# Altium project MODEM.PrjPCB
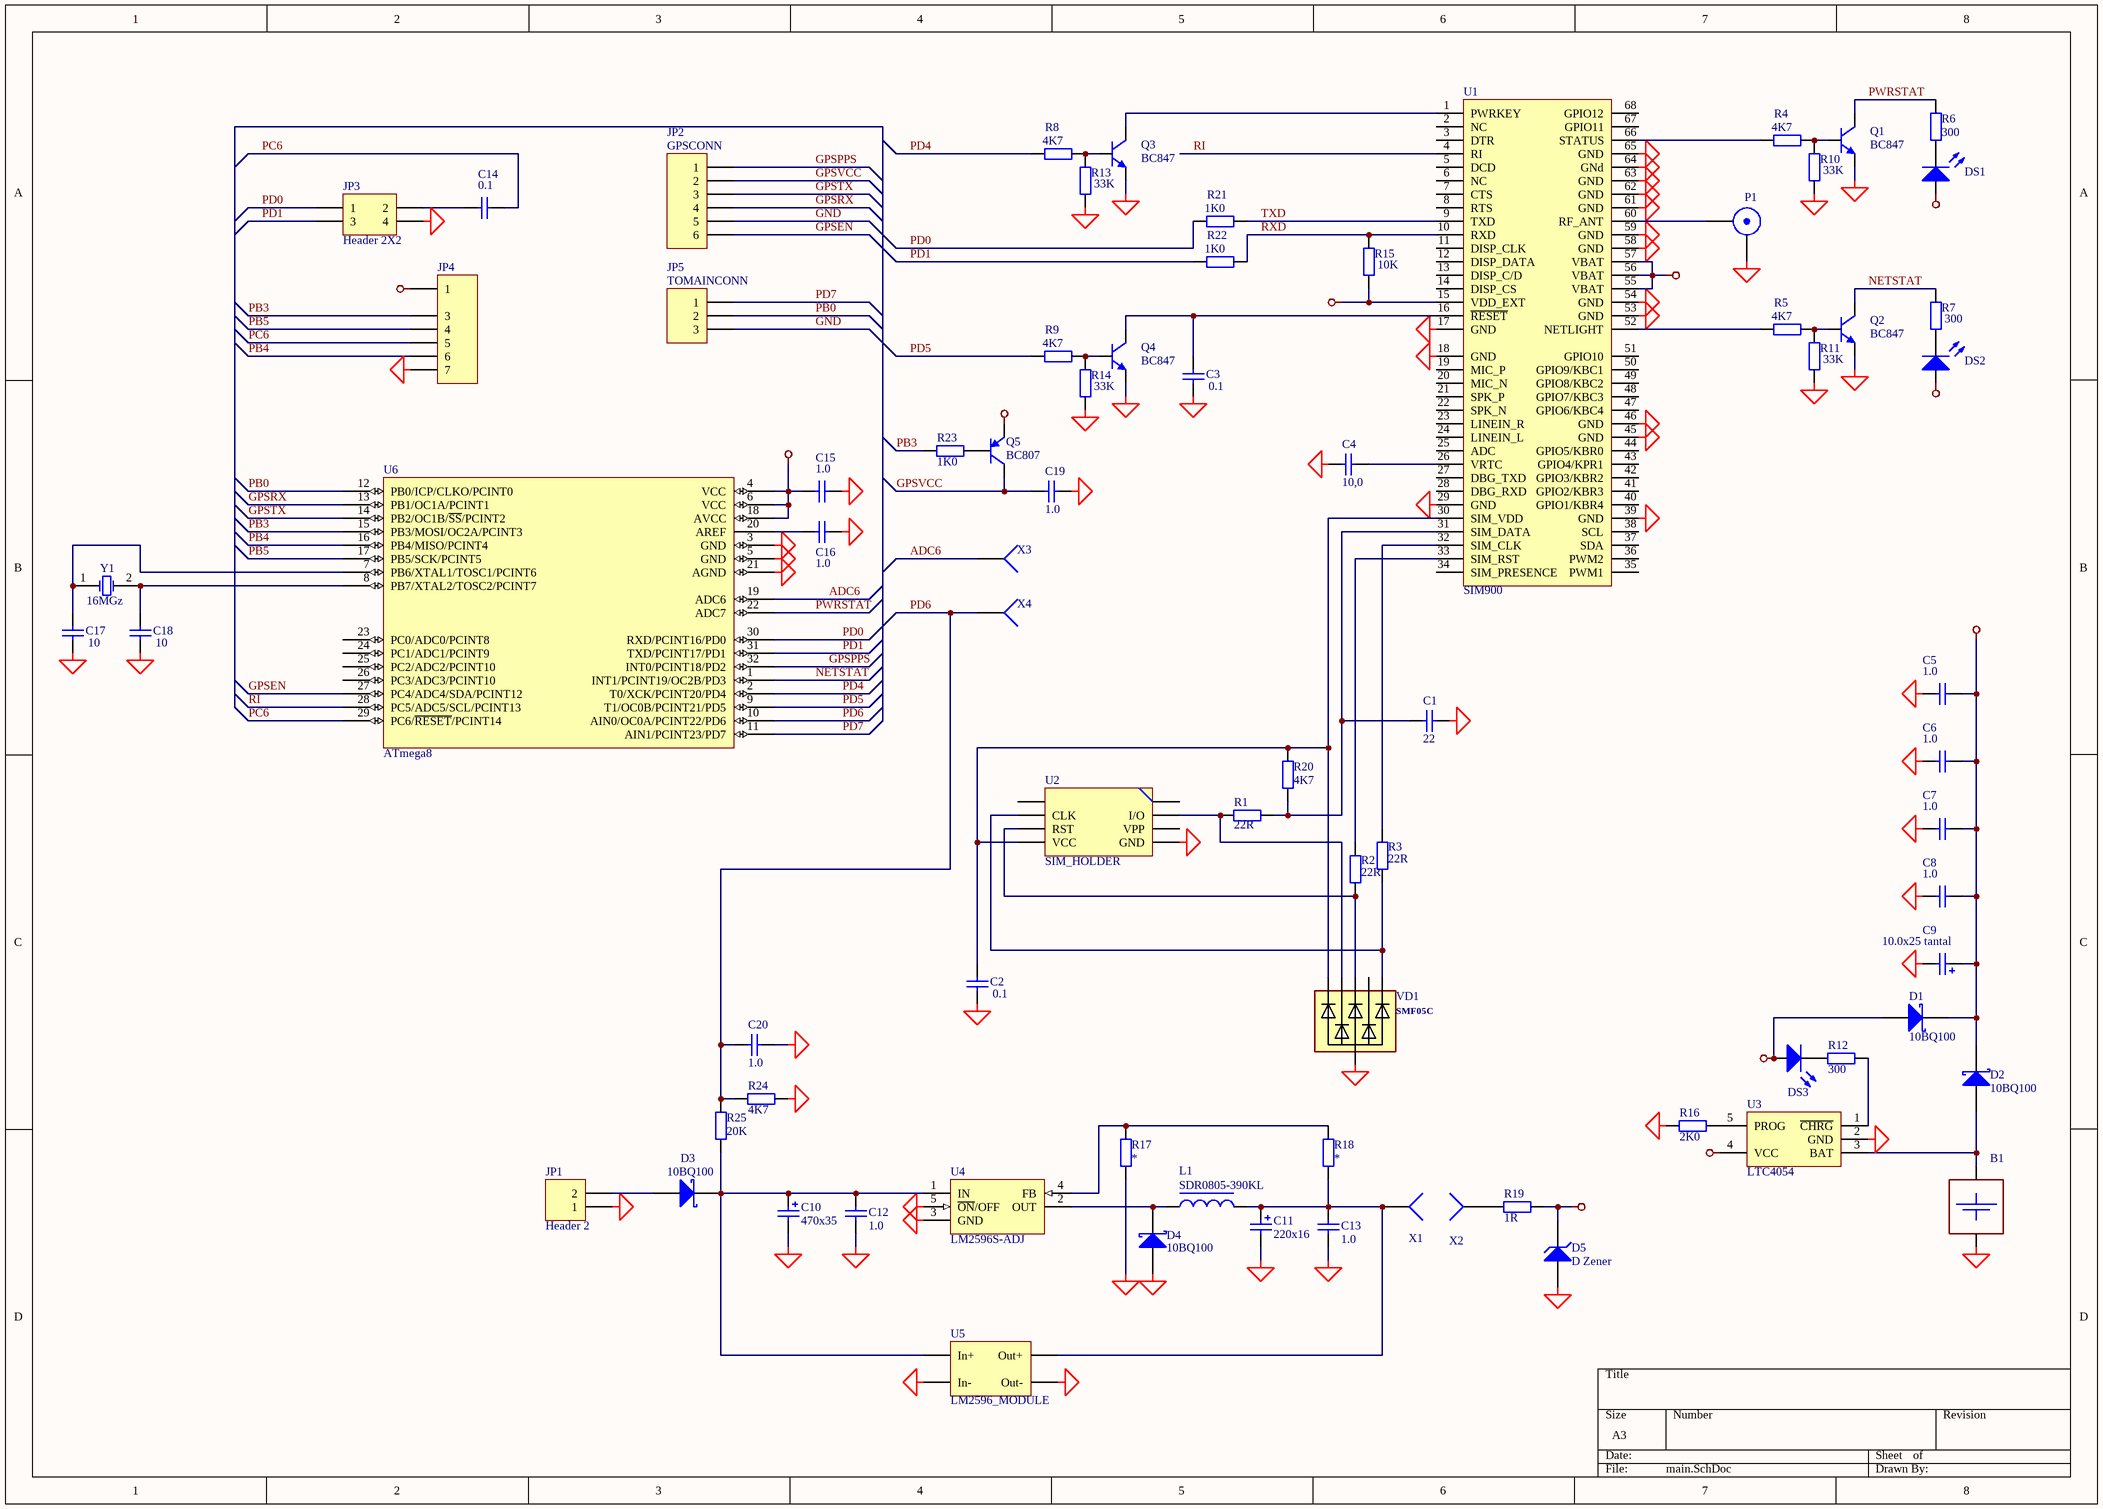
[diagram p0: main.SchDoc]
1 sheet, 78 parts. Net scope: global (net labels, ports and power ports of the same name join across sheets).
Board file: main.PcbDoc

## Sheet main.SchDoc
size A3

### Parts
B1  BAT18650_HOLDER  [BAT18650_HOLDER]  (value not drawn)
C1  22  [_1206]
C2  0.1  [_1206]
C3  0.1  [_1206]
C4  10,0  [_1206]
C5  1.0  [_1206]
C6  1.0  [_1206]
C7  1.0  [_1206]
C8  1.0  [_1206]
C9  10.0x25 tantal  [CAP_EL_6_3]
C10  value 470x35  [el5]
C11  value 220x16  [el3]
C12  value 1.0  [_1206]  (hidden comment: Cap)
C13  value 1.0  [_1206]  (hidden comment: Cap)
C14  0.1  [_1206]
C15  1.0  [_1206]
C16  1.0  [_1206]
C17  10  [_1206]
C18  10  [_1206]
C19  1.0  [_1206]
C20  value 1.0  [_1206]  (hidden comment: Cap)
D1  10BQ100  [DSO-C2/X2.3]
D2  10BQ100  [DSO-C2/X2.3]
D3  10BQ100  [DSO-C2/X2.3]
D4  10BQ100  [DSO-C2/X2.3]
D5  D Zener  [_1206d]
DS1  LED0  [el3]  (value not drawn)
DS2  LED0  [el3]  (value not drawn)
DS3  LED0  [el3]  (value not drawn)
JP1  Header 2  [BT5-2]
JP2  GPSCONN  [HDR1X6]
JP3  Header 2X2  [HDR2X2]
JP4  AVR_conn  [AVR_CONN]  (value not drawn)
JP5  TOMAINCONN  [HDR1X3]
L1  SDR0805-390KL  [L10x10]
P1  SMB  [SMB_V-RJ45]  (value not drawn)
Q1  BC847  [SO-G3/C2.5]
Q2  BC847  [SO-G3/C2.5]
Q3  BC847  [SO-G3/C2.5]
Q4  BC847  [SO-G3/C2.5]
Q5  BC807  [SO-G3/C2.5]
R1  22R  [_1206]
R2  22R  [_1206]
R3  22R  [_1206]
R4  4K7  [_1206]
R5  4K7  [_1206]
R6  300  [_1206]
R7  300  [_1206]
R8  4K7  [_1206]
R9  4K7  [_1206]
R10  33K  [_1206]
R11  33K  [_1206]
R12  300  [_1206]
R13  33K  [_1206]
R14  33K  [_1206]
R15  10K  [_1206]
R16  2K0  [_1206]
R17  *  [_1206]
R18  *  [_1206]
R19  1R  [_1206]
R20  4K7  [_1206]
R21  1K0  [_1206]
R22  1K0  [_1206]
R23  value 1K0  [_1206]  (hidden comment: Res2)
R24  4K7  [_1206]
R25  20K  [_1206]
U1  SIM900  [SIM900F]
U2  SIM_HOLDER  [SIM_HOLDER_1]
U3  LTC4054  [SO-G5/P.95]
U4  LM2596S-ADJ  [SIP-G5/Y2.1]
U5  LM2596_MODULE  [LM2596_MODULE_1]
U6  ATmega8  [QFP7X7-G32/X.5N]
VD1  *  [sot363]  (value not drawn)
X1  Socket  [PIN1]  (value not drawn)
X2  Socket  [PIN1]  (value not drawn)
X3  Socket  [PIN1]  (value not drawn)
X4  Socket  [PIN1]  (value not drawn)
Y1  16MGz  [qwarz1]

### Nets
+5v: D1.1(A) D5.2(K) DS3.1(A) R19.2 U3.4(VCC)
GND: B1.2(-) C1.1 C2.1 C3.1 C4.2 C5.1 C6.1 C7.1 C8.1 C9.2 C10.2 C11.2 C12.1 C13.1 C15.1 C16.1 C17.1 C18.1 C19.1 C20.1 D4.1(A) D5.1(A) JP1.1 JP2.5 JP3.4 JP4.7 JP5.3 P1.2(Y) Q1.2(E) Q2.2(E) Q3.2(E) Q4.2(E) R10.2 R11.2 R13.2 R14.2 R16.2 R17.2 R24.2 U1.17(GND) U1.18(GND) U1.29(GND) U1.39(GND) U1.45(GND) U1.46(GND) U1.53(GND) U1.54(GND) U1.58(GND) U1.59(GND) U1.61(GND) U1.62(GND) U1.63(GND) U1.64(GNd) U1.65(GND) U2.5(GND) U3.2(GND) U4.3(GND) U4.5(~{ON}/OFF) U5.2(In-) U5.3(Out-) U6.3(GND) U6.5(GND) U6.21(AGND) VD1.2
VBAT: C5.2 C6.2 C7.2 C8.2 C9.1 C15.2 D1.2(K) D2.2(K) DS1.1(A) DS2.1(A) JP4.1 Q5.2(E) U1.55(VBAT) U1.56(VBAT) U1.57(VBAT) U6.4(VCC) U6.6(VCC) U6.18(AVCC)
VDD_EXT: R15.2 U1.15(VDD_EXT)
ADC6: U6.19(ADC6) X3.1
GPSEN: JP2.6 U6.27(PC4/ADC4/SDA/PCINT12)
GPSPPS: JP2.1 U6.32(INT0/PCINT18/PD2)
GPSRX: JP2.4 U6.13(PB1/OC1A/PCINT1)
GPSTX: JP2.3 U6.14(PB2/OC1B/~{SS}/PCINT2)
GPSVCC: C19.2 JP2.2 Q5.3(C)
NETSTAT: Q2.3(C) R7.1 U6.1(INT1/PCINT19/OC2B/PD3)
PB0: JP5.2 U6.12(PB0/ICP/CLKO/PCINT0)
PB3: JP4.3 R23.2 U6.15(PB3/MOSI/OC2A/PCINT3)
PB4: JP4.6 U6.16(PB4/MISO/PCINT4)
PB5: JP4.4 U6.17(PB5/SCK/PCINT5)
PC6: C14.1 JP4.5 U6.29(PC6/~{RESET}/PCINT14)
PD0: JP3.1 R21.2 U6.30(RXD/PCINT16/PD0)
PD1: JP3.3 R22.2 U6.31(TXD/PCINT17/PD1)
PD4: R8.2 U6.2(T0/XCK/PCINT20/PD4)
PD5: R9.2 U6.9(T1/OC0B/PCINT21/PD5)
PD6: C20.2 R24.1 R25.1 U6.10(AIN0/OC0A/PCINT22/PD6) X4.1
PD7: JP5.1 U6.11(AIN1/PCINT23/PD7)
PWRSTAT: Q1.3(C) R6.2 U6.22(ADC7)
RI: U1.4(RI) U6.28(PC5/ADC5/SCL/PCINT13)
RXD: R15.1 R22.1 U1.10(RXD)
TXD: R21.1 U1.9(TXD)
NetB1_1: B1.1(+) D2.1(A) U3.3(BAT)
NetC1_2: C1.2 R1.1 R20.2 U1.31(SIM_DATA)
NetC2_2: C2.2 R20.1 U1.30(SIM_VDD) U2.4(VCC) VD1.1
NetC3_2: C3.2 Q4.3(C) U1.16(~{RESET})
NetC4_1: C4.1 U1.26(VRTC)
NetC10_1: C10.1 C12.2 D3.2(K) R25.2 U4.1(IN) U5.1(In+)
NetC11_1: C11.1 C13.2 L1.2 R18.2 U5.4(Out+) X1.1
NetC14_2: C14.2 JP3.2
NetC16_2: C16.2 U6.20(AREF)
NetC17_2: C17.2 U6.7(PB6/XTAL1/TOSC1/PCINT6) Y1.1(OSC1)
NetC18_2: C18.2 U6.8(PB7/XTAL2/TOSC2/PCINT7) Y1.2(OSC2)
NetD3_1: D3.1(A) JP1.2
NetD4_2: D4.2(K) L1.1 U4.2(OUT)
NetDS1_2: DS1.2(K) R6.1
NetDS2_2: DS2.2(K) R7.2
NetDS3_2: DS3.2(K) R12.2
NetP1_1: P1.1(X) U1.60(RF_ANT)
NetQ1_1: Q1.1(B) R4.1 R10.1
NetQ2_1: Q2.1(B) R5.1 R11.1
NetQ3_1: Q3.1(B) R8.1 R13.1
NetQ3_3: Q3.3(C) U1.1(PWRKEY)
NetQ4_1: Q4.1(B) R9.1 R14.1
NetQ5_1: Q5.1(B) R23.1
NetR1_2: R1.2 U2.7(I/O) VD1.3
NetR2_1: R2.1 U1.33(SIM_RST)
NetR2_2: R2.2 U2.3(RST) VD1.4
NetR3_1: R3.1 U1.32(SIM_CLK)
NetR3_2: R3.2 U2.2(CLK) VD1.6
NetR4_2: R4.2 U1.66(STATUS)
NetR5_2: R5.2 U1.52(NETLIGHT)
NetR12_1: R12.1 U3.1(~{CHRG})
NetR16_1: R16.1 U3.5(PROG)
NetR17_1: R17.1 R18.1 U4.4(FB)
NetR19_1: R19.1 X2.1

Not connected (* = marked no-connect by the designer): U1 2(NC) 3(DTR) 5(DCD) 6(NC) 7(CTS) 8(RTS) 11(DISP_CLK) 12(DISP_DATA) 13(DISP_C/D) 14(DISP_CS) 19(MIC_P) 20(MIC_N) 21(SPK_P) 22(SPK_N) 23(LINEIN_R) 24(LINEIN_L) 25(ADC) 27(DBG_TXD) 28(DBG_RXD) 34(SIM_PRESENCE) 35(PWM1) 36(PWM2) 37(SDA) 38(SCL) 40(GPIO1/KBR4) 41(GPIO2/KBR3) 42(GPIO3/KBR2) 43(GPIO4/KPR1) 44(GPIO5/KBR0) 47(GPIO6/KBC4) 48(GPIO7/KBC3) 49(GPIO8/KBC2) 50(GPIO9/KBC1) 51(GPIO10) 67(GPIO11) 68(GPIO12); U2 1 6(VPP) 8; U6 23(PC0/ADC0/PCINT8) 24(PC1/ADC1/PCINT9) 25(PC2/ADC2/PCINT10) 26(PC3/ADC3/PCINT10); VD1 5

### Library data of the parts
C1-C8 C14-C19 = Cap Semi: Capacitor; Manufacturer: Generic Components; Class I: Passive; Value: 0,1; Published: 8-Jun-2000; Revision: July-2002: Re-released for DXP Platform.; Publisher: Altium Limited; Class II: Capacitor
C9 = Cap Pol1: Polarized Capacitor (Radial); Manufacturer: Generic Components; Class I: Passive; Value: 10,0x25; Published: 8-Jun-2000; Revision: July-2002: Re-released for DXP Platform.; Publisher: Altium Limited; Class II: Capacitor
C10 C11 = Cap Pol: Polarized Capacitor (Radial); Manufacturer: Generic Components; Class I: Passive; Published: 8-Jun-2000; Revision: July-2002: Re-released for DXP Platform.; Publisher: Altium Limited; Class II: Capacitor
C12 C13 C20 = Cap: Capacitor; Manufacturer: Generic Components; Class I: Passive; Published: 8-Jun-2000; Revision: July-2002: Re-released for DXP Platform.; Publisher: Altium Limited; Class II: Capacitor
D1-D4 = 10BQ015: Schottky Rectifier; Manufacturer: International Rectifier; Revision 1: 10-July-2000: SIM Model Added.; Revision 2: July-2002: Re-released for DXP Platform.; Class I: Discrete; Class II: Rectifier - Schottky; Published: 8-Jun-2000; Datasheet: Latest Revision: PD-2.396A; Package Reference: DO-214AA; Publisher: Altium Limited
D5 = D Zener: Zener Diode; Manufacturer: Generic Components; Class I: Discrete; Class II: Diode - Zener; Published: 8-Jun-2000; Revision: July-2002: Re-released for DXP Platform.; Publisher: Altium Limited
DS1-DS3 = LED0: Typical INFRARED GaAs LED; Manufacturer: Generic Components; Class I: Optoelectronic; Published: 8-Jun-2000; Revision: July-2002: Re-released for DXP Platform.; Publisher: Altium Limited; Class II: LED
JP1 = Header 2: Header, 2-Pin; Manufacturer: Generic Components; Class I: Connector; Revision: July-2002: Re-released for DXP Platform.; Publisher: Altium Limited
JP2 = Header 6: Header, 6-Pin; Manufacturer: Generic Components; Class I: Connector; Revision: July-2002: Re-released for DXP Platform.; Publisher: Altium Limited
JP3 = Header 2X2: Header, 2-Pin, Dual row; Manufacturer: Generic Components; Class I: Connector; Revision: July-2002: Re-released for DXP Platform.; Publisher: Altium Limited
JP4 = AVR_conn: Header, 7-Pin; Manufacturer: Generic Components; Class I: Connector; Revision: July-2002: Re-released for DXP Platform.; Publisher: Altium Limited
JP5 = Header 3: Header, 3-Pin; Manufacturer: Generic Components; Class I: Connector; Revision: July-2002: Re-released for DXP Platform.; Publisher: Altium Limited
L1 = Inductor Konstr 2: Magnetic-Core Inductor; Manufacturer: Generic Components; Class I: Passive; Published: 24-Mar-1999; Revision: July-2002: Re-released for DXP Platform.; Publisher: Altium Limited; Class II: Inductor
P1 = SMB: SMB Straight Connector; Manufacturer: Generic Components; Class II: RF Coaxial; Revision: July-2002: Re-released for DXP Platform.; Publisher: Altium Limited; Class I: Connector
Q1-Q4 = BC847ALT1: General Purpose Transistor NPN Silicon; Manufacturer: Motorola; Package Information: Latest Revision: 1997; Class I: Discrete; Class II: BJT - Low Power; Published: 29-Sep-2000; Revision: July-2002: Re-released for DXP Platform.; Datasheet: Latest Revision: 1997; Package Reference: 318-08; Publisher: Altium Limited
Q5 = BC857ALT1: General Purpose Transistor PNP Silicon; Manufacturer: Motorola; Package Information: Latest Revision: 1997; Class I: Discrete; Class II: BJT - Low Power; Published: 29-Sep-2000; Revision: July-2002: Re-released for DXP Platform.; Datasheet: Latest Revision: 1997; Package Reference: 318-08; Publisher: Altium Limited
R1-R3 R17-R20 R24 R25 = Res2: Resistor; Manufacturer: Generic Components; Class I: Passive; Value: 10K; Rule: Undefined; Published: 8-Jun-2000; Revision: July-2002: Re-released for DXP Platform.; Publisher: Altium Limited; Class II: Resistor
R4 R5 R8 R9 R21 R22 = Res2: Resistor; Manufacturer: Generic Components; Class I: Passive; Value: 1K; Published: 8-Jun-2000; Revision: July-2002: Re-released for DXP Platform.; Publisher: Altium Limited; Class II: Resistor
R6 R7 R10-R14 R16 = Res2: Resistor; Manufacturer: Generic Components; Class I: Passive; Value: 10K; Published: 8-Jun-2000; Revision: July-2002: Re-released for DXP Platform.; Publisher: Altium Limited; Class II: Resistor
R15 R23 = Res2: Resistor; Manufacturer: Generic Components; Class I: Passive; Published: 8-Jun-2000; Revision: July-2002: Re-released for DXP Platform.; Publisher: Altium Limited; Class II: Resistor
  R15: Value: 10K
U4 = LM2596S-ADJ: Simple Switcher Power Converter 150 kHz 3A Step Down Voltage Regulator; Manufacturer: National Semiconductor; Class I: Power Management; Class II: Switching Regulator; Note: Tab is connected to GND; Published: 15-Apr-2002; Datasheet: Latest Revision: Dec-1997; Package Reference: TS5B; Publisher: Altium Limited
U6 = ATmega48/TQFP: Right: 180; Bottom: 200
VD1 = SMF05C: ManufacturerPartNumber: SMF05C
X1-X4 = Socket: Manufacturer: Generic Components; Class I: Connector; Revision: July-2002: Re-released for DXP Platform.; Publisher: Altium Limited
Y1 = XTAL: Crystal Oscillator; Manufacturer: Generic Components; Published: 8-Jun-2000; Revision: July-2002: Re-released for DXP Platform.; Publisher: Altium Limited; Class I: Oscillator; Class II: Crystal Oscillator